# Altium schematic sheet FPGA_U1_Auto.SchDoc
size B; Generated From FPGA Project: FPGA_Project_NRES_RTD_board_rev1.PrjFpg; UNUSED_SPECIAL: RouteSeparate; UNUSED_IO: NoERC; VREF: NoERC; UNUSED_INPUT: NoERC
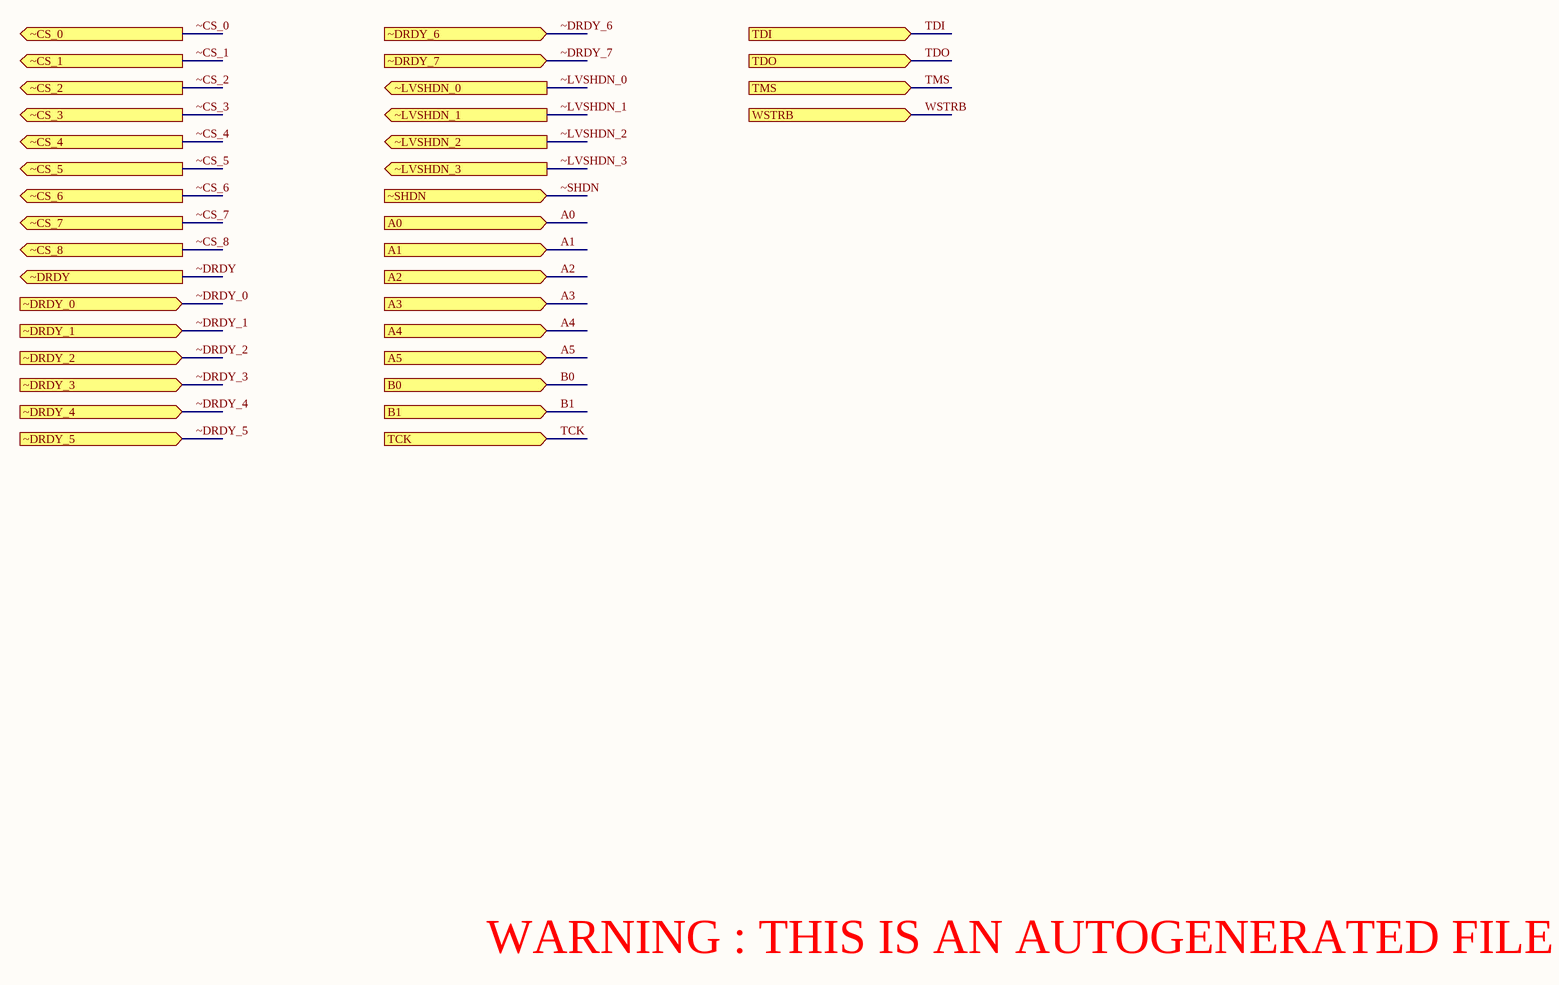
[diagram p0: FPGA_U1_Auto.SchDoc]

## Ports
A0 (in), A1 (in), A2 (in), A3 (in), A4 (in), A5 (in), B0 (in), B1 (in), TCK (in), TDI (in), TDO (in), TMS (in), WSTRB (in), ~CS_0 (out), ~CS_1 (out), ~CS_2 (out), ~CS_3 (out), ~CS_4 (out), ~CS_5 (out), ~CS_6 (out), ~CS_7 (out), ~CS_8 (out), ~DRDY (out), ~DRDY_0 (in), ~DRDY_1 (in), ~DRDY_2 (in), ~DRDY_3 (in), ~DRDY_4 (in), ~DRDY_5 (in), ~DRDY_6 (in), ~DRDY_7 (in), ~LVSHDN_0 (out), ~LVSHDN_1 (out), ~LVSHDN_2 (out), ~LVSHDN_3 (out), ~SHDN (in)

## Nets
A0: port A0
A1: port A1
A2: port A2
A3: port A3
A4: port A4
A5: port A5
B0: port B0
B1: port B1
TCK: port TCK
TDI: port TDI
TDO: port TDO
TMS: port TMS
WSTRB: port WSTRB
~CS_0: port ~CS_0
~CS_1: port ~CS_1
~CS_2: port ~CS_2
~CS_3: port ~CS_3
~CS_4: port ~CS_4
~CS_5: port ~CS_5
~CS_6: port ~CS_6
~CS_7: port ~CS_7
~CS_8: port ~CS_8
~DRDY: port ~DRDY
~DRDY_0: port ~DRDY_0
~DRDY_1: port ~DRDY_1
~DRDY_2: port ~DRDY_2
~DRDY_3: port ~DRDY_3
~DRDY_4: port ~DRDY_4
~DRDY_5: port ~DRDY_5
~DRDY_6: port ~DRDY_6
~DRDY_7: port ~DRDY_7
~LVSHDN_0: port ~LVSHDN_0
~LVSHDN_1: port ~LVSHDN_1
~LVSHDN_2: port ~LVSHDN_2
~LVSHDN_3: port ~LVSHDN_3
~SHDN: port ~SHDN

## Notes on the sheet
- WARNING : THIS IS AN AUTOGENERATED FILE